# EasyEDA schematic PCB_Design.json
TITLE: Sheet_1; REV: 1.0; Date: 2025-04-22; Sheet: 1/1; Drawn By: bemphenr; Company: Your Company
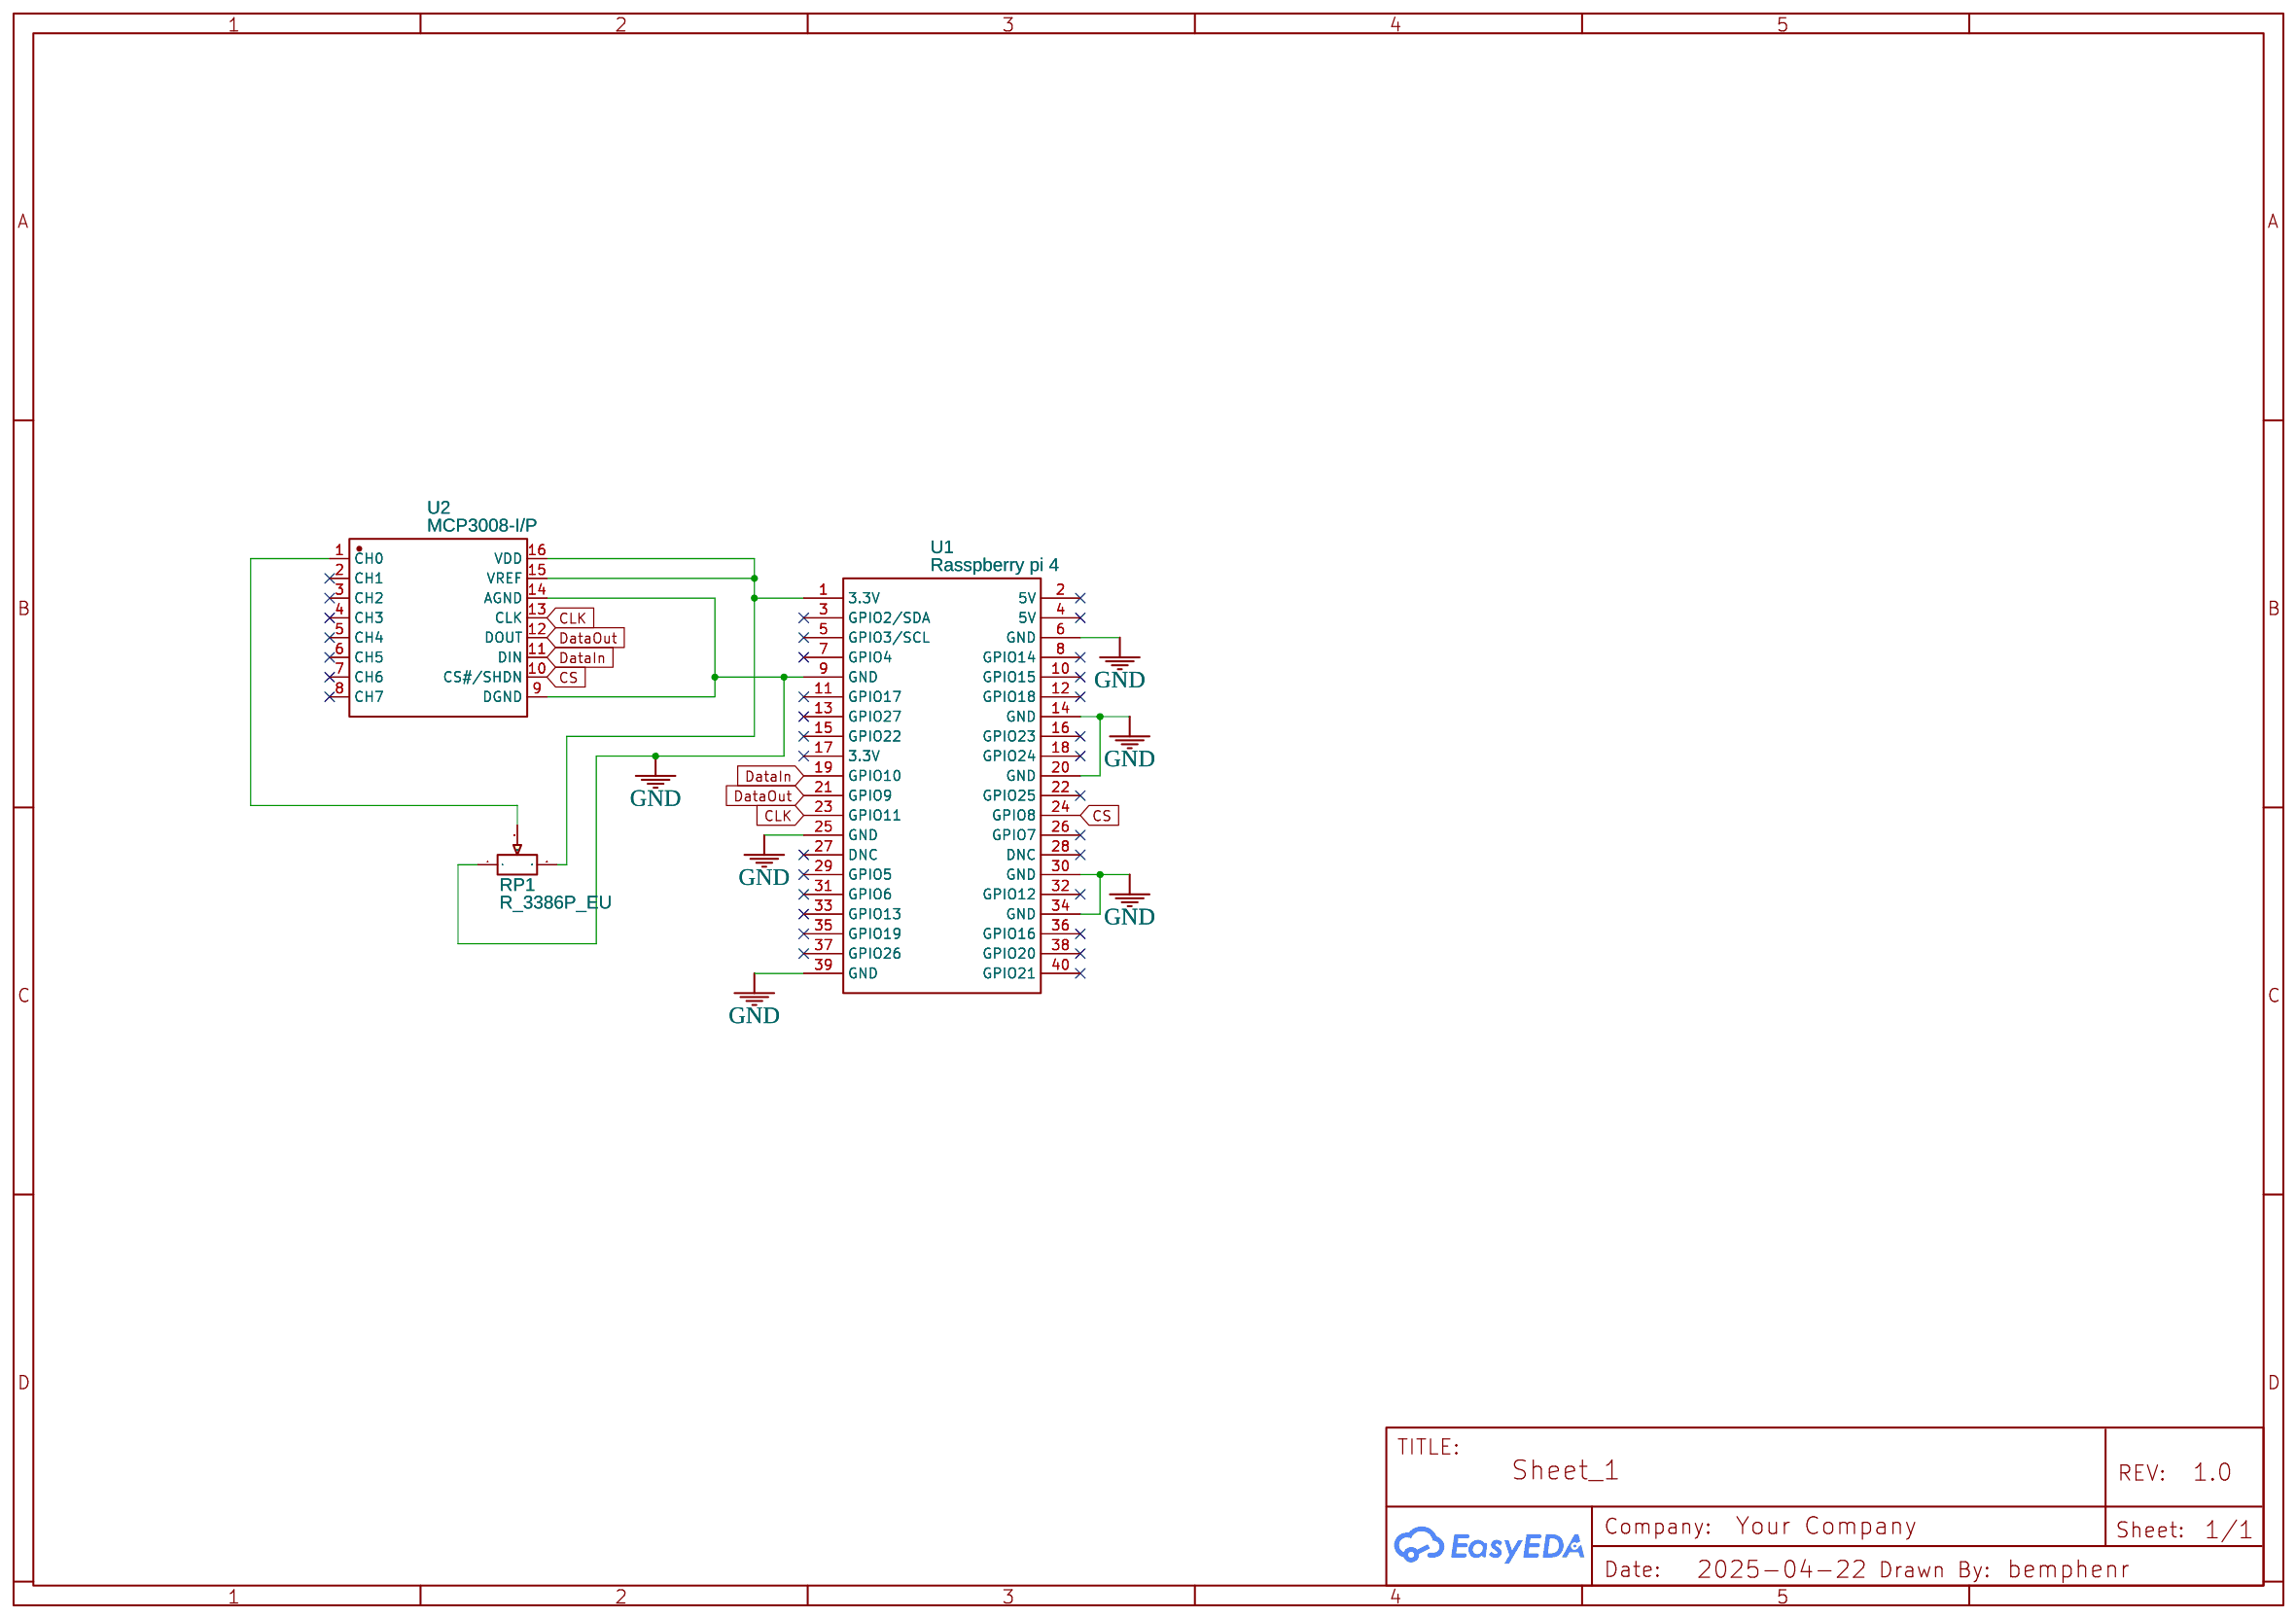
[diagram p0: schematic sheet]

## Parts
RP1  R_3386P_EU  [RES-ADJ-TH_3386P]
U1  Rasspberry pi 4  [RASPBERRY PI 2B V2]
U2  MCP3008-I/P  [PDIP-16_L19.3-W6.5-P2.54-LS7.6-BL]

## Library data of the parts
RP1 = R_3386P_EU: Supplier: LCSC; Contributor: LCEDA_Lib; Value(Ω): 10K
U1 = Rasspberry pi 4: Contributor: mohamed_abdelkhalek
U2 = MCP3008-I/P: Contributor: LCSC; Supplier: LCSC; Supplier Part: C2890491; Manufacturer: MICROCHIP(美国微芯); JLCPCB Part Class: Extended Part

## Nets
GND: RP1.1 U1.6(GND) U1.9(GND) U1.14(GND) U1.20(GND) U1.25(GND) U1.30(GND) U1.34(GND) U1.39(GND) U2.9(DGND) U2.14(AGND)
CLK: U1.23(GPIO11) U2.13(CLK)
CS: U1.24(GPIO8) U2.10(CS#/SHDN)
DataIn: U1.19(GPIO10) U2.11(DIN)
DataOut: U1.21(GPIO9) U2.12(DOUT)
Net-(RP1-2): RP1.2 U2.1(CH0)
Net-(RP1-3): RP1.3 U1.1(3.3V) U2.15(VREF) U2.16(VDD)

Not connected (* = marked no-connect by the designer): U1 2(5V)* 3(GPIO2/SDA)* 4(5V)* 5(GPIO3/SCL)* 7(GPIO4)* 8(GPIO14)* 10(GPIO15)* 11(GPIO17)* 12(GPIO18)* 13(GPIO27)* 15(GPIO22)* 16(GPIO23)* 17(3.3V)* 18(GPIO24)* 22(GPIO25)* 26(GPIO7)* 27(DNC)* 28(DNC)* 29(GPIO5)* 31(GPIO6)* 32(GPIO12)* 33(GPIO13)* 35(GPIO19)* 36(GPIO16)* 37(GPIO26)* 38(GPIO20)* 40(GPIO21)*; U2 2(CH1)* 3(CH2)* 4(CH3)* 5(CH4)* 6(CH5)* 7(CH6)* 8(CH7)*
